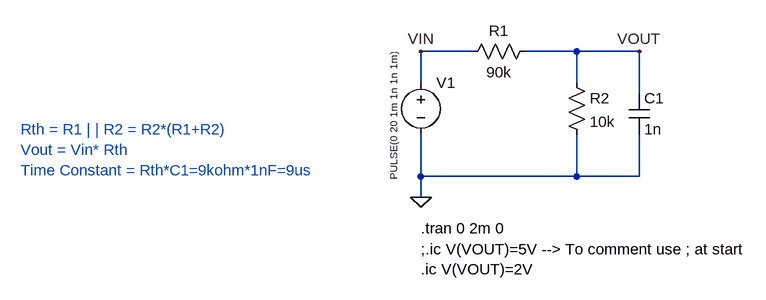
[diagram p0: schematic 02-Initial Condition.asc]
02-Initial Condition.asc, the LTspice schematic file:
Version 4
SHEET 1 880 680
WIRE 64 80 -16 80
WIRE 224 80 144 80
WIRE 320 80 224 80
WIRE -16 128 -16 80
WIRE 224 128 224 80
WIRE 320 144 320 80
WIRE -16 272 -16 208
WIRE 224 272 224 208
WIRE 224 272 -16 272
WIRE 320 272 320 208
WIRE 320 272 224 272
WIRE -16 304 -16 272
FLAG -16 304 0
FLAG -16 80 VIN
FLAG 320 80 VOUT
SYMBOL voltage -16 112 R0
WINDOW 3 -42 -28 VRight 1
WINDOW 123 0 0 Left 0
WINDOW 39 0 0 Left 0
SYMATTR InstName V1
SYMATTR Value PULSE(0 20 1m 1n 1n 1m)
SYMBOL res 48 96 R270
WINDOW 0 32 56 VTop 2
WINDOW 3 0 56 VBottom 2
SYMATTR InstName R1
SYMATTR Value 90k
SYMBOL res 208 112 R0
SYMATTR InstName R2
SYMATTR Value 10k
SYMBOL cap 304 144 R0
SYMATTR InstName C1
SYMATTR Value 1n
TEXT -632 200 Left 2 ;Rth = R1 | | R2 = R2*(R1+R2)\nVout = Vin* Rth\nTime Constant = Rth*C1=9kohm*1nF=9us
TEXT -16 352 Left 2 !.tran 0 2m 0
TEXT -16 384 Left 2 !;.ic V(VOUT)=5V --> To comment use ; at start\n.ic V(VOUT)=2V

The netlist it stands for:
* 02-Initial Condition.asc
V1 VIN 0 PULSE(0 20 1m 1n 1n 1m)
R1 VIN VOUT 90k
R2 VOUT 0 10k
C1 VOUT 0 1n
* Rth = R1 | | R2 = R2*(R1+R2)
* Vout = Vin* Rth
* Time Constant = Rth*C1=9kohm*1nF=9us
.tran 0 2m 0
;.ic V(VOUT)=5V --> To comment use ; at start
.ic V(VOUT)=2V
.backanno
.end